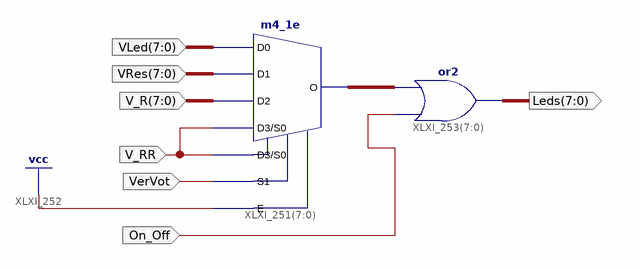
[diagram p0: schematic sheet 1]
// Xilinx ISE schematic Ctrl_Leds.sch (spartan6) as structural Verilog: 2 symbols, 7 ports
module Ctrl_Leds (
  input  [7:0] VLed,
  input  [7:0] VRes,
  input  [7:0] V_R,
  input  V_RR,
  input  On_Off,
  input  VerVot,
  output [7:0] Leds
);

  wire [7:0] XLXN_41;

  m4_1e XLXI_251[7:0] (.D0(VLed), .D1(VRes), .D2(V_R), .D3(V_RR), .E(1'b1), .S0(V_RR), .S1(VerVot), .O(XLXN_41));
  assign Leds = {8{On_Off}} | XLXN_41;  // or2 XLXI_253[7..0], 8 bits wide
endmodule
